# Altium schematic sheet 00_BoardDiagramEntryConn.SchDoc: Board Diagram Entry Connection
size A3; Author: NeoExiZ; CompanyName: BUPT CPS Lab; Engineer: NeoExiZ; Organization: NeoExiZ; Address1: 418, 4#Building,BUPT; Address2: No.10, Xitucheng Road; Address3: Beijing; Address4: China
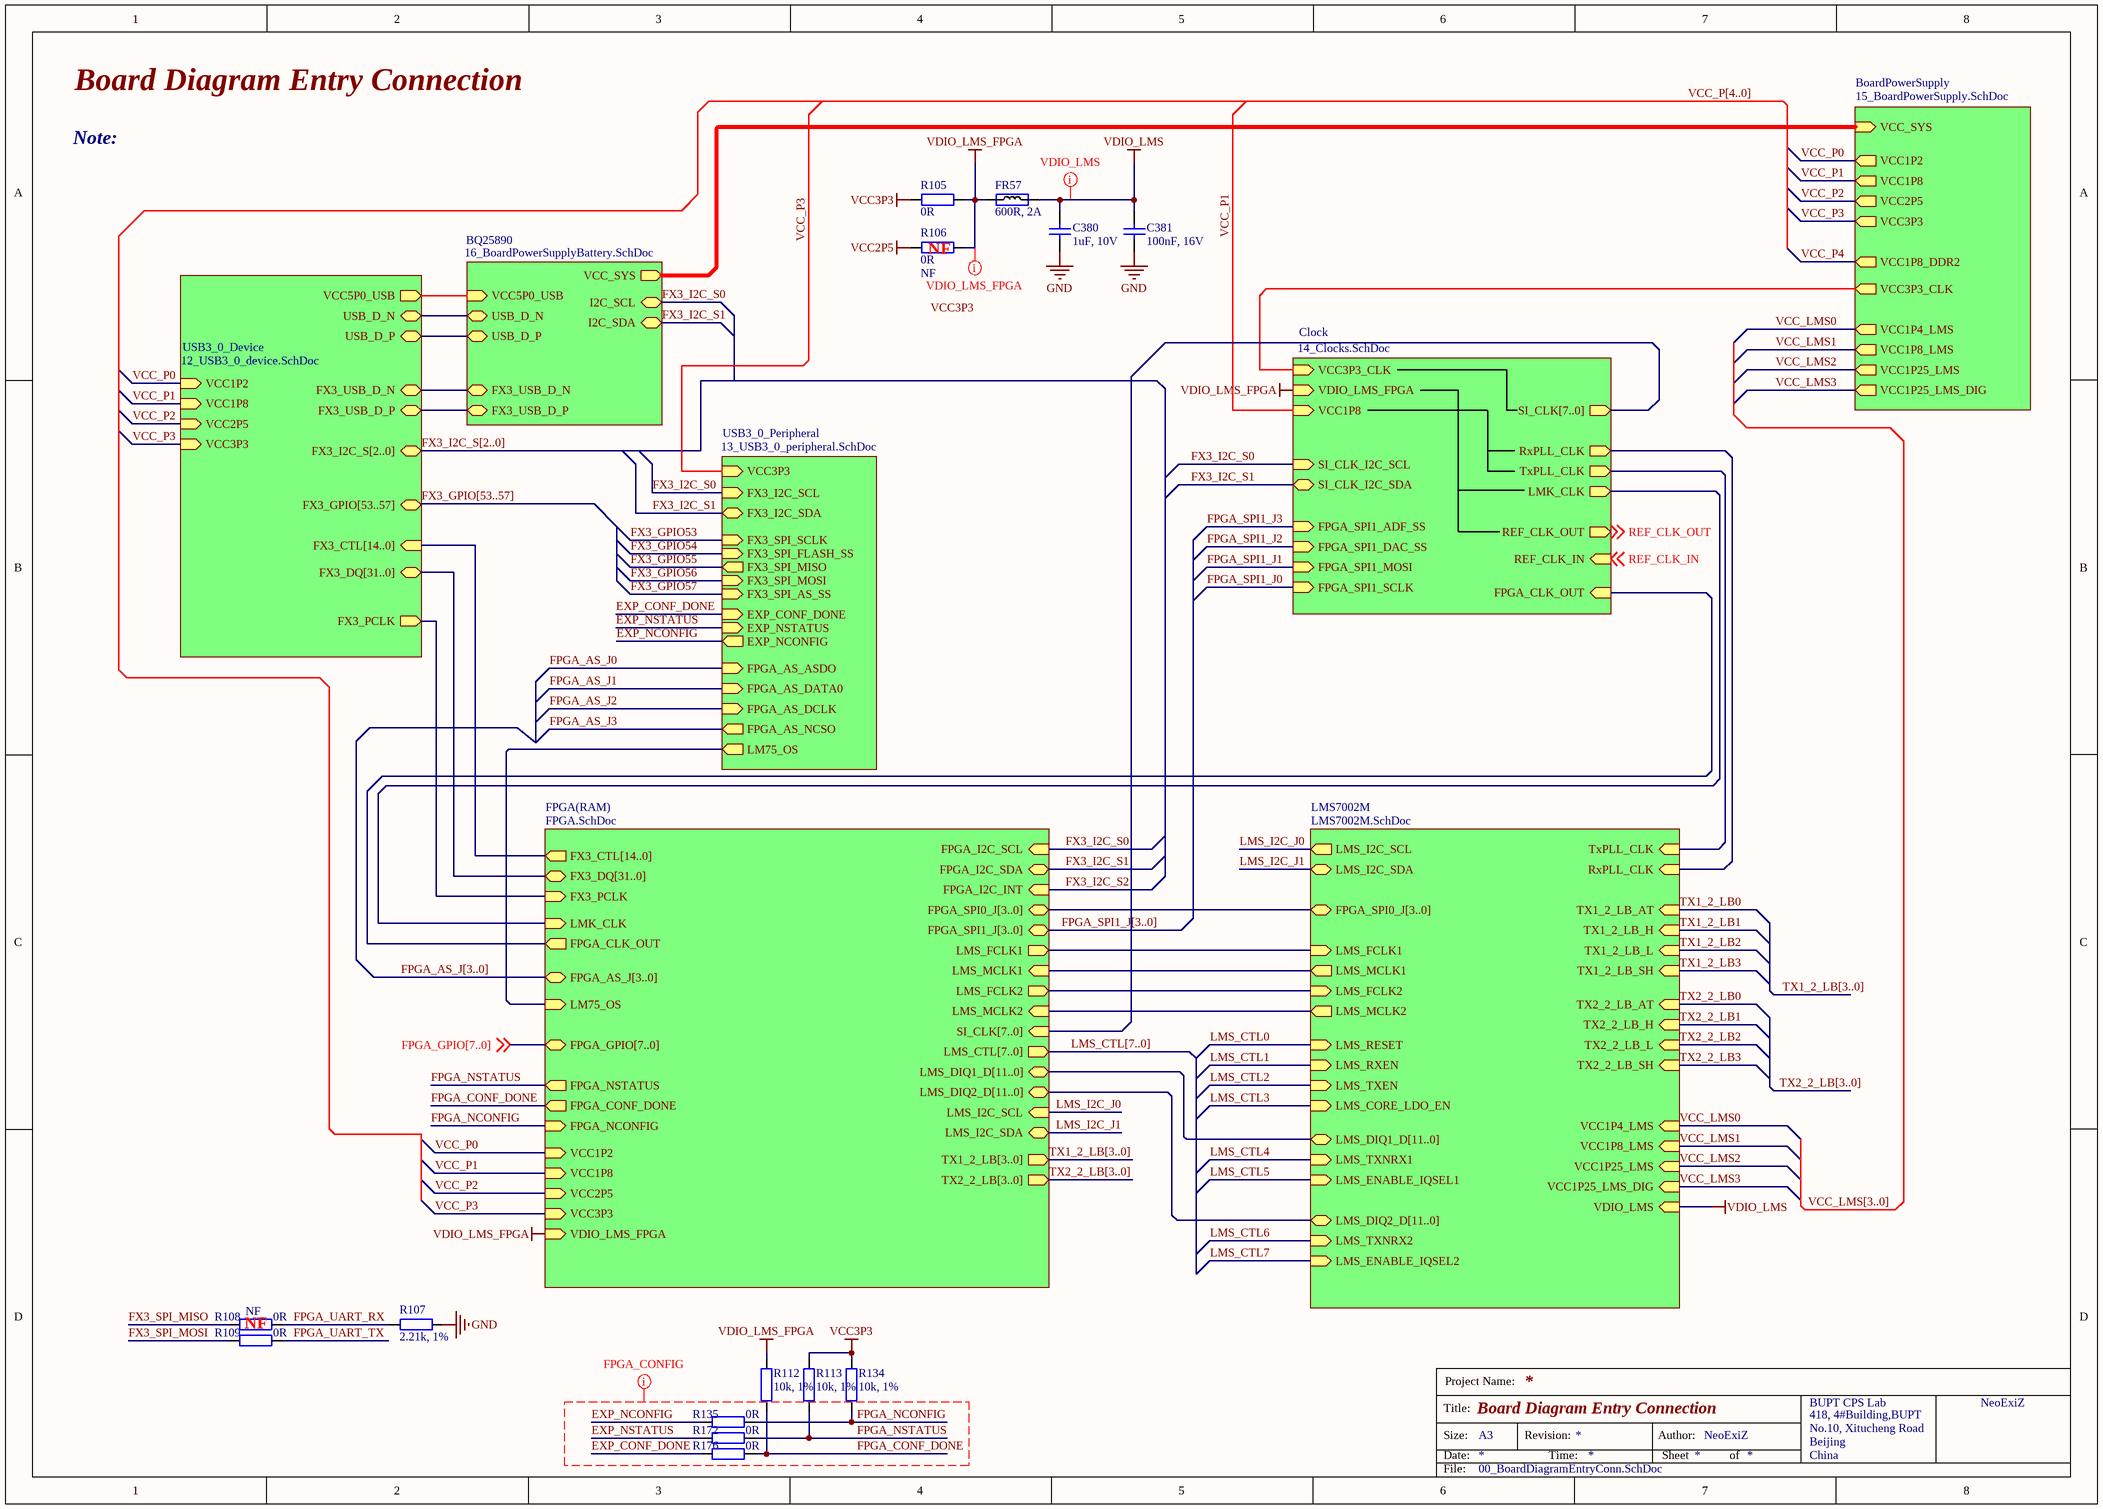
[diagram p0: 00_BoardDiagramEntryConn.SchDoc]

## Parts
C380  1uF, 10V  [CAP0402]
C381  100nF, 16V  [CAP0402]
FR57  600R, 2A  [RES0805]
R105  0R  [RES0402]
R106  0R  Assembly Info: NF  [RES0402]
R107  2.21k, 1%  [RES0402]
R108  0R  Assembly Info: NF  [RES0402]
R109  0R  [RES0402]
R112  10k, 1%  [RES0402]
R113  10k, 1%  [RES0402]
R134  10k, 1%  [RES0402]
R135  0R  [RES0402]
R172  0R  [RES0402]
R176  0R  [RES0402]

## Sub-sheets
BoardPowerSupply = 15_BoardPowerSupply.SchDoc: VCC3P3 (out), VCC2P5 (out), VCC1P2 (out), VCC3P3_CLK (out), VCC1P4_LMS (out), VCC1P8_LMS (out), VCC1P25_LMS (out), VCC1P25_LMS_DIG (out), VCC1P8 (out), VCC1P8_DDR2 (out), VCC_SYS (in)
BQ25890 = 16_BoardPowerSupplyBattery.SchDoc: VCC5P0_USB (in), FX3_USB_D_N (bidir), FX3_USB_D_P (bidir), USB_D_N (bidir), USB_D_P (bidir), I2C_SCL, I2C_SDA, VCC_SYS (out)
Clock = 14_Clocks.SchDoc: VDIO_LMS_FPGA (in), VCC3P3_CLK (in), VCC1P8 (in), REF_CLK_IN (in), REF_CLK_OUT (out), SI_CLK[7..0] (out), RxPLL_CLK (out), TxPLL_CLK (out), SI_CLK_I2C_SCL (in), SI_CLK_I2C_SDA (bidir), FPGA_CLK_OUT (in), FPGA_SPI1_ADF_SS (in), FPGA_SPI1_DAC_SS (in), FPGA_SPI1_MOSI (in), FPGA_SPI1_SCLK (in), LMK_CLK (out)
FPGA(RAM) = FPGA.SchDoc: SI_CLK[7..0] (in), FX3_DQ[31..0] (bidir), FX3_PCLK (in), FX3_CTL[14..0] (out), LMS_MCLK1 (in), LMS_MCLK2 (in), FPGA_NSTATUS (out), FPGA_CONF_DONE (out), FPGA_NCONFIG (in), FPGA_SPI0_J[3..0], LMS_FCLK1 (out), LMS_FCLK2 (out), FPGA_I2C_SDA (bidir), FPGA_I2C_SCL (in), FPGA_I2C_INT (in), FPGA_SPI1_J[3..0], LMK_CLK (in), LMS_CTL[7..0] (out), LMS_DIQ1_D[11..0] (bidir), LMS_DIQ2_D[11..0] (bidir), FPGA_CLK_OUT (out), FPGA_AS_J[3..0], LM75_OS (in), FPGA_GPIO[7..0] (bidir), LMS_I2C_SDA (bidir), LMS_I2C_SCL (in), TX1_2_LB[3..0] (out), TX2_2_LB[3..0] (out), VCC1P2 (in), VCC1P8 (in), VCC3P3 (in), VDIO_LMS_FPGA (in), VCC2P5 (in)
LMS7002M = LMS7002M.SchDoc: FPGA_SPI0_J[3..0] (bidir), LMS_FCLK1 (in), LMS_FCLK2 (in), LMS_MCLK1 (out), LMS_MCLK2 (out), LMS_I2C_SCL (out), LMS_I2C_SDA (bidir), RxPLL_CLK (in), TxPLL_CLK (in), LMS_DIQ2_D[11..0] (bidir), LMS_DIQ1_D[11..0] (bidir), LMS_ENABLE_IQSEL1 (in), LMS_ENABLE_IQSEL2 (in), LMS_TXNRX1 (in), LMS_TXNRX2 (in), LMS_CORE_LDO_EN (in), LMS_RESET (in), LMS_RXEN (in), LMS_TXEN (in), TX2_2_LB_AT (in), TX2_2_LB_H (in), TX2_2_LB_L (in), TX2_2_LB_SH (in), TX1_2_LB_SH (in), TX1_2_LB_L (in), TX1_2_LB_H (in), TX1_2_LB_AT (in), VCC1P4_LMS (in), VCC1P8_LMS (in), VCC1P25_LMS (in), VCC1P25_LMS_DIG (in), VDIO_LMS (in)
USB3_0_Device = 12_USB3_0_device.SchDoc: VCC1P2 (in), VCC1P8 (in), VCC2P5 (in), VCC3P3 (in), FX3_CTL[14..0] (in), FX3_DQ[31..0] (bidir), FX3_GPIO[53..57] (bidir), FX3_PCLK (out), FX3_USB_D_N (bidir), FX3_USB_D_P (bidir), FX3_I2C_S[2..0], VCC5P0_USB (out), USB_D_N (bidir), USB_D_P (bidir)
USB3_0_Peripheral = 13_USB3_0_peripheral.SchDoc: EXP_NCONFIG (out), EXP_NSTATUS (in), FPGA_AS_ASDO (in), FPGA_AS_DATA0 (in), FPGA_AS_DCLK (in), FPGA_AS_NCSO (out), EXP_CONF_DONE (in), LM75_OS (out), FX3_I2C_SCL (in), FX3_I2C_SDA (bidir), FX3_SPI_AS_SS (in), FX3_SPI_FLASH_SS (in), FX3_SPI_MISO (out), FX3_SPI_MOSI (in), FX3_SPI_SCLK (in), VCC3P3 (in)

## Nets
GND: C380.1 C381.2 R107.1
VCC2P5: R106.2
VCC3P3: R105.2 R113.1 R134.1
VDIO_LMS: C380.2 C381.1 FR57.2 ; sheet LMS7002M/VDIO_LMS
VDIO_LMS_FPGA: FR57.1 R105.1 R106.1 R112.1 ; sheet Clock/VDIO_LMS_FPGA, sheet FPGA(RAM)/VDIO_LMS_FPGA
EXP_CONF_DONE: R176.1 ; sheet USB3_0_Peripheral/EXP_CONF_DONE
EXP_NCONFIG: R135.1 ; sheet USB3_0_Peripheral/EXP_NCONFIG
EXP_NSTATUS: R172.1 ; sheet USB3_0_Peripheral/EXP_NSTATUS
FPGA_AS_J0: sheet USB3_0_Peripheral/FPGA_AS_ASDO
FPGA_AS_J1: sheet USB3_0_Peripheral/FPGA_AS_DATA0
FPGA_AS_J2: sheet USB3_0_Peripheral/FPGA_AS_DCLK
FPGA_AS_J3: sheet USB3_0_Peripheral/FPGA_AS_NCSO
FPGA_CONF_DONE: R112.2 R176.2 ; sheet FPGA(RAM)/FPGA_CONF_DONE
FPGA_NCONFIG: R134.2 R135.2 ; sheet FPGA(RAM)/FPGA_NCONFIG
FPGA_NSTATUS: R113.2 R172.2 ; sheet FPGA(RAM)/FPGA_NSTATUS
FPGA_SPI1_J0: sheet Clock/FPGA_SPI1_SCLK
FPGA_SPI1_J1: sheet Clock/FPGA_SPI1_MOSI
FPGA_SPI1_J2: sheet Clock/FPGA_SPI1_DAC_SS
FPGA_SPI1_J3: sheet Clock/FPGA_SPI1_ADF_SS
FPGA_UART_RX: R107.2 R108.2
FPGA_UART_TX: R109.2
FX3_GPIO53: sheet USB3_0_Peripheral/FX3_SPI_SCLK
FX3_GPIO54: sheet USB3_0_Peripheral/FX3_SPI_FLASH_SS
FX3_GPIO55: sheet USB3_0_Peripheral/FX3_SPI_MISO
FX3_GPIO56: sheet USB3_0_Peripheral/FX3_SPI_MOSI
FX3_GPIO57: sheet USB3_0_Peripheral/FX3_SPI_AS_SS
FX3_I2C_S0: sheet BQ25890/I2C_SCL, sheet Clock/SI_CLK_I2C_SCL, sheet USB3_0_Peripheral/FX3_I2C_SCL, sheet FPGA(RAM)/FPGA_I2C_SCL
FX3_I2C_S1: sheet BQ25890/I2C_SDA, sheet Clock/SI_CLK_I2C_SDA, sheet USB3_0_Peripheral/FX3_I2C_SDA, sheet FPGA(RAM)/FPGA_I2C_SDA
FX3_I2C_S2: sheet FPGA(RAM)/FPGA_I2C_INT
FX3_SPI_MISO: R108.1
FX3_SPI_MOSI: R109.1
LMS_CTL0: sheet LMS7002M/LMS_RESET
LMS_CTL1: sheet LMS7002M/LMS_RXEN
LMS_CTL2: sheet LMS7002M/LMS_TXEN
LMS_CTL3: sheet LMS7002M/LMS_CORE_LDO_EN
LMS_CTL4: sheet LMS7002M/LMS_TXNRX1
LMS_CTL5: sheet LMS7002M/LMS_ENABLE_IQSEL1
LMS_CTL6: sheet LMS7002M/LMS_TXNRX2
LMS_CTL7: sheet LMS7002M/LMS_ENABLE_IQSEL2
LMS_I2C_J0: sheet FPGA(RAM)/LMS_I2C_SCL, sheet LMS7002M/LMS_I2C_SCL
LMS_I2C_J1: sheet FPGA(RAM)/LMS_I2C_SDA, sheet LMS7002M/LMS_I2C_SDA
REF_CLK_IN: off-sheet REF_CLK_IN, sheet Clock/REF_CLK_IN
REF_CLK_OUT: off-sheet REF_CLK_OUT, sheet Clock/REF_CLK_OUT
TX1_2_LB0: sheet LMS7002M/TX1_2_LB_AT
TX1_2_LB1: sheet LMS7002M/TX1_2_LB_H
TX1_2_LB2: sheet LMS7002M/TX1_2_LB_L
TX1_2_LB3: sheet LMS7002M/TX1_2_LB_SH
TX2_2_LB0: sheet LMS7002M/TX2_2_LB_AT
TX2_2_LB1: sheet LMS7002M/TX2_2_LB_H
TX2_2_LB2: sheet LMS7002M/TX2_2_LB_L
TX2_2_LB3: sheet LMS7002M/TX2_2_LB_SH
VCC_LMS0: sheet BoardPowerSupply/VCC1P4_LMS, sheet LMS7002M/VCC1P4_LMS
VCC_LMS1: sheet BoardPowerSupply/VCC1P8_LMS, sheet LMS7002M/VCC1P8_LMS
VCC_LMS2: sheet BoardPowerSupply/VCC1P25_LMS, sheet LMS7002M/VCC1P25_LMS
VCC_LMS3: sheet BoardPowerSupply/VCC1P25_LMS_DIG, sheet LMS7002M/VCC1P25_LMS_DIG
VCC_P0: sheet BoardPowerSupply/VCC1P2, sheet USB3_0_Device/VCC1P2, sheet FPGA(RAM)/VCC1P2
VCC_P1: sheet BoardPowerSupply/VCC1P8, sheet Clock/VCC1P8, sheet USB3_0_Device/VCC1P8, sheet FPGA(RAM)/VCC1P8
VCC_P2: sheet BoardPowerSupply/VCC2P5, sheet USB3_0_Device/VCC2P5, sheet FPGA(RAM)/VCC2P5
VCC_P3: sheet BoardPowerSupply/VCC3P3, sheet USB3_0_Device/VCC3P3, sheet USB3_0_Peripheral/VCC3P3, sheet FPGA(RAM)/VCC3P3
VCC_P4: sheet BoardPowerSupply/VCC1P8_DDR2
(unnamed): sheet BoardPowerSupply/VCC3P3_CLK, sheet Clock/VCC3P3_CLK
(unnamed): sheet BoardPowerSupply/VCC_SYS, sheet BQ25890/VCC_SYS
(unnamed): sheet BQ25890/VCC5P0_USB, sheet USB3_0_Device/VCC5P0_USB
(unnamed): sheet BQ25890/FX3_USB_D_N, sheet USB3_0_Device/FX3_USB_D_N
(unnamed): sheet BQ25890/FX3_USB_D_P, sheet USB3_0_Device/FX3_USB_D_P
(unnamed): sheet BQ25890/USB_D_N, sheet USB3_0_Device/USB_D_N
(unnamed): sheet BQ25890/USB_D_P, sheet USB3_0_Device/USB_D_P
(unnamed): sheet Clock/RxPLL_CLK, sheet LMS7002M/RxPLL_CLK
(unnamed): sheet Clock/TxPLL_CLK, sheet LMS7002M/TxPLL_CLK
(unnamed): sheet Clock/FPGA_CLK_OUT, sheet FPGA(RAM)/FPGA_CLK_OUT
(unnamed): sheet Clock/LMK_CLK, sheet FPGA(RAM)/LMK_CLK
(unnamed): sheet USB3_0_Device/FX3_PCLK, sheet FPGA(RAM)/FX3_PCLK
(unnamed): sheet USB3_0_Peripheral/LM75_OS, sheet FPGA(RAM)/LM75_OS
(unnamed): sheet FPGA(RAM)/LMS_MCLK1, sheet LMS7002M/LMS_MCLK1
(unnamed): sheet FPGA(RAM)/LMS_MCLK2, sheet LMS7002M/LMS_MCLK2
(unnamed): sheet FPGA(RAM)/LMS_FCLK1, sheet LMS7002M/LMS_FCLK1
(unnamed): sheet FPGA(RAM)/LMS_FCLK2, sheet LMS7002M/LMS_FCLK2

## Buses and harness runs
bus FPGA_AS_J[3..0] = sheet FPGA(RAM)/FPGA_AS_J[3..0]
bus FPGA_SPI1_J[3..0] = sheet FPGA(RAM)/FPGA_SPI1_J[3..0]
bus FX3_GPIO[53..57] = sheet USB3_0_Device/FX3_GPIO[53..57]
bus FX3_I2C_S[2..0] = sheet USB3_0_Device/FX3_I2C_S[2..0]
bus LMS_CTL[7..0] = sheet FPGA(RAM)/LMS_CTL[7..0]
bus sheet Clock/SI_CLK[7..0] = sheet FPGA(RAM)/SI_CLK[7..0]
bus sheet FPGA(RAM)/FPGA_SPI0_J[3..0] = sheet LMS7002M/FPGA_SPI0_J[3..0]
bus sheet FPGA(RAM)/FX3_CTL[14..0] = sheet USB3_0_Device/FX3_CTL[14..0]
bus sheet FPGA(RAM)/FX3_DQ[31..0] = sheet USB3_0_Device/FX3_DQ[31..0]
bus sheet FPGA(RAM)/LMS_DIQ1_D[11..0] = sheet LMS7002M/LMS_DIQ1_D[11..0]
bus sheet FPGA(RAM)/LMS_DIQ2_D[11..0] = sheet LMS7002M/LMS_DIQ2_D[11..0]
bus TX1_2_LB[3..0]
bus TX1_2_LB[3..0] = sheet FPGA(RAM)/TX1_2_LB[3..0]
bus TX2_2_LB[3..0]
bus TX2_2_LB[3..0] = sheet FPGA(RAM)/TX2_2_LB[3..0]
bus VCC_LMS[3..0]
bus VCC_P[4..0]

## Layout directives
net class FPGA_CONFIG: EXP_CONF_DONE, EXP_NCONFIG, EXP_NSTATUS, FPGA_CONF_DONE, FPGA_NCONFIG, FPGA_NSTATUS
net class VDIO_LMS: VDIO_LMS
net class VDIO_LMS_FPGA: VDIO_LMS_FPGA

## Notes on the sheet
- (near R106) NF
- (near R108) NF
- Labels drawn without touching a wire or pin: VCC3P3
- Note:
- Project Name:
- Size:
- Date:
- Title:
- A3
- Revision:
- Time:
- Author:
- Sheet
- of
- File:

## Library data of the parts
C380 = Cap_0402: Manufacturer Part Number 1: GRM155R61A105KE15J; Manufacturer: TDK; Part Description: 1µF ±10% 10V X5R Ceramic Capacitor -55°C ~ 85°C Surface Mount, MLCC 0402 (1005 Metric) 0.039" L x 0.020" W (1.00mm x 0.50mm); Voltage Rating: 10; Capacitance Tolerance: ± 10%; Product Range: TDK - C Series; Ceramic Capacitor Case: 0402 [1005 Metric]; Capacitance: 1; Dielectric Characteristic: X6; Value: 1uF, 10V; Supplier 1: Newark; Supplier Part Number 1: 490-6298-2-ND; MSL: -; RoHS: YES
C381 = Cap_0402: Manufacturer: Murata Electronics; Manufacturer Part Number: GRM155R71C104KA88D; Part Description: 0.10µF ±10% 16V X7R Ceramic Capacitor -55°C ~ 125°C Surface Mount, MLCC 0402 (1005 Metric) 0.039" L x 0.020" W (1.00mm x 0.50mm); Tolerance: 10 %; Type: General Purpose MLCC; Capacitance: 0.1 uF; Case Length: 1 mm; Dielectric: X7R; Case Height: 0.5 mm; Temperature Coefficient / Code: +/- 15 %; Value: 100nF, 16V; Supplier 1: Mouser; Supplier Part Number 1: 81-GRM155R71C104KA88; Case Code - in: 0402; RoHS: RoHS Compliant; Operating Temperature Range: - 55 C to + 125 C; Series: GRM; Termination Style: SMD/SMT; Package / Case: 0402 (1005 metric); Voltage Rating DC: 16 V; Maximum Operating Temperature: + 125 C; Case Code - mm: 1005; Minimum Operating Temperature: - 55 C; Product Category: Low & Medium Capacitance SMD Ceramic Chip Capacitors; Packaging: Reel; Product: General Type MLCCs; Category: Multilayer Ceramic Capacitors MLCC - SMD/SMT; Brand: Murata Electronics; Case Width: 0.5 mm; RoHS - Mouser: Y; Standard Pack Qty: 10000; Minimum Order Quantity: 1; Reeling: True; Manufacturer Part Number 1: GRM155R71C104KA88D
FR57 = Ferrite: Manufacturer Part Number 1: MPZ2012S601AT000; Manufacturer: TDK Corporation; Part Description: FERRITE BEAD 600 OHM 0805 1LN; Filter Type: Differential Mode - Single; Impedance @ Frequency: 600 Ohm @ 100MHz; DC Resistance (DCR): 100 mOhm Max; Supplier 1: Digi-Key; Supplier Part Number 1: 445-2206-2-ND; Mounting Type: Surface Mount; RoHS: RoHS Compliant; Height (Max): 0.041" (1.05mm); Packaging: Tape & Reel (TR); Category: Filters; Current Rating: 2A; Package / Case: 0805 (2012 Metric); Size / Dimension: 0.079" L x 0.049" W (2.00mm x 1.25mm); Value: 600R, 2A
R105 R106 = Res_0402: Manufacturer Part Number 1: RC0402JR-070RL; Manufacturer: Yageo; Part Description: RES SMD 0.0OHM JUMPER 1/16W 0402; Resistance (Ohms): 0.0; Tolerance: Jumper; Power (Watts): 0.063W, 1/16W; Value: 0R; Supplier 1: Digi-Key; Supplier Part Number 1: 311-0.0JRTR-ND; Category: Resistors; Temperature Coefficient: -; Features: Moisture Resistant; Supplier Device Package: 0402; Height: 0.016" (0.40mm); Package / Case: 0402 (1005 Metric); Operating Temperature: -55°C ~ 155°C; Size / Dimension: 0.039" L x 0.020" W (1.00mm x 0.50mm); Composition: Thick Film; Packaging: Tape & Reel (TR); Number of Terminations: 2; RoHS: RoHS Compliant
R107 = Res_0402: Manufacturer: Stackpole Electronics Inc.; Manufacturer Part Number 1: RMCF0402FT2K21; Part Description: RES SMD 2.21K OHM 1% 1/16W 0402; Power (Watts): 0.063W, 1/16W; Temperature Coefficient: ±100ppm/°C; Value: 2.21k, 1%; Supplier 1: Digi-Key; Supplier Part Number 1: RMCF0402FT2K21CT-ND; Operating Temperature: -55°C ~ 155°C; Height: 0.016" (0.40mm); Tolerance: ±1%; Resistance (Ohms): 2.21k; Features: Automotive AEC-Q200; Package / Case: 0402 (1005 Metric); Packaging: Cut Tape (CT); Composition: Thick Film; Category: Resistors; Supplier Device Package: 0402; Number of Terminations: 2; RoHS: RoHS Compliant; Size / Dimension: 0.039" L x 0.020" W (1.00mm x 0.50mm)
R108 R109 R135 R172 R176 = Res_0402: Manufacturer: Yageo; Part Description: RES SMD 0.0OHM JUMPER 1/16W 0402; Supplier 1: Digi-Key; Supplier Part Number 1: 311-0.0JRTR-ND; Composition: Thick Film; Package / Case: 0402 (1005 Metric); Category: Resistors; Value: 0R
R112 R113 R134 = Res_0402: Manufacturer: Yageo; Manufacturer Part Number 1: RC0402FR-0710KL; Part Description: RES SMD 10K OHM 1% 1/16W 0402; Temperature Coefficient: ±100ppm/°C; Power (Watts): 0.063W, 1/16W; Value: 10k, 1%; Supplier 1: Digi-Key; Supplier Part Number 1: 311-10.0KLRTR-ND; Resistance (Ohms): 10k; Packaging: Tape & Reel (TR); RoHS: RoHS Compliant; Package / Case: 0402 (1005 Metric); Tolerance: ±1%; Operating Temperature: -55°C ~ 155°C; Size / Dimension: 0.039" L x 0.020" W (1.00mm x 0.50mm); Number of Terminations: 2; Category: Resistors; Height: 0.016" (0.40mm); Supplier Device Package: 0402; Features: Moisture Resistant; Composition: Thick Film